# Altium schematic sheet LowCurrentSwitch.SchDoc
size A4
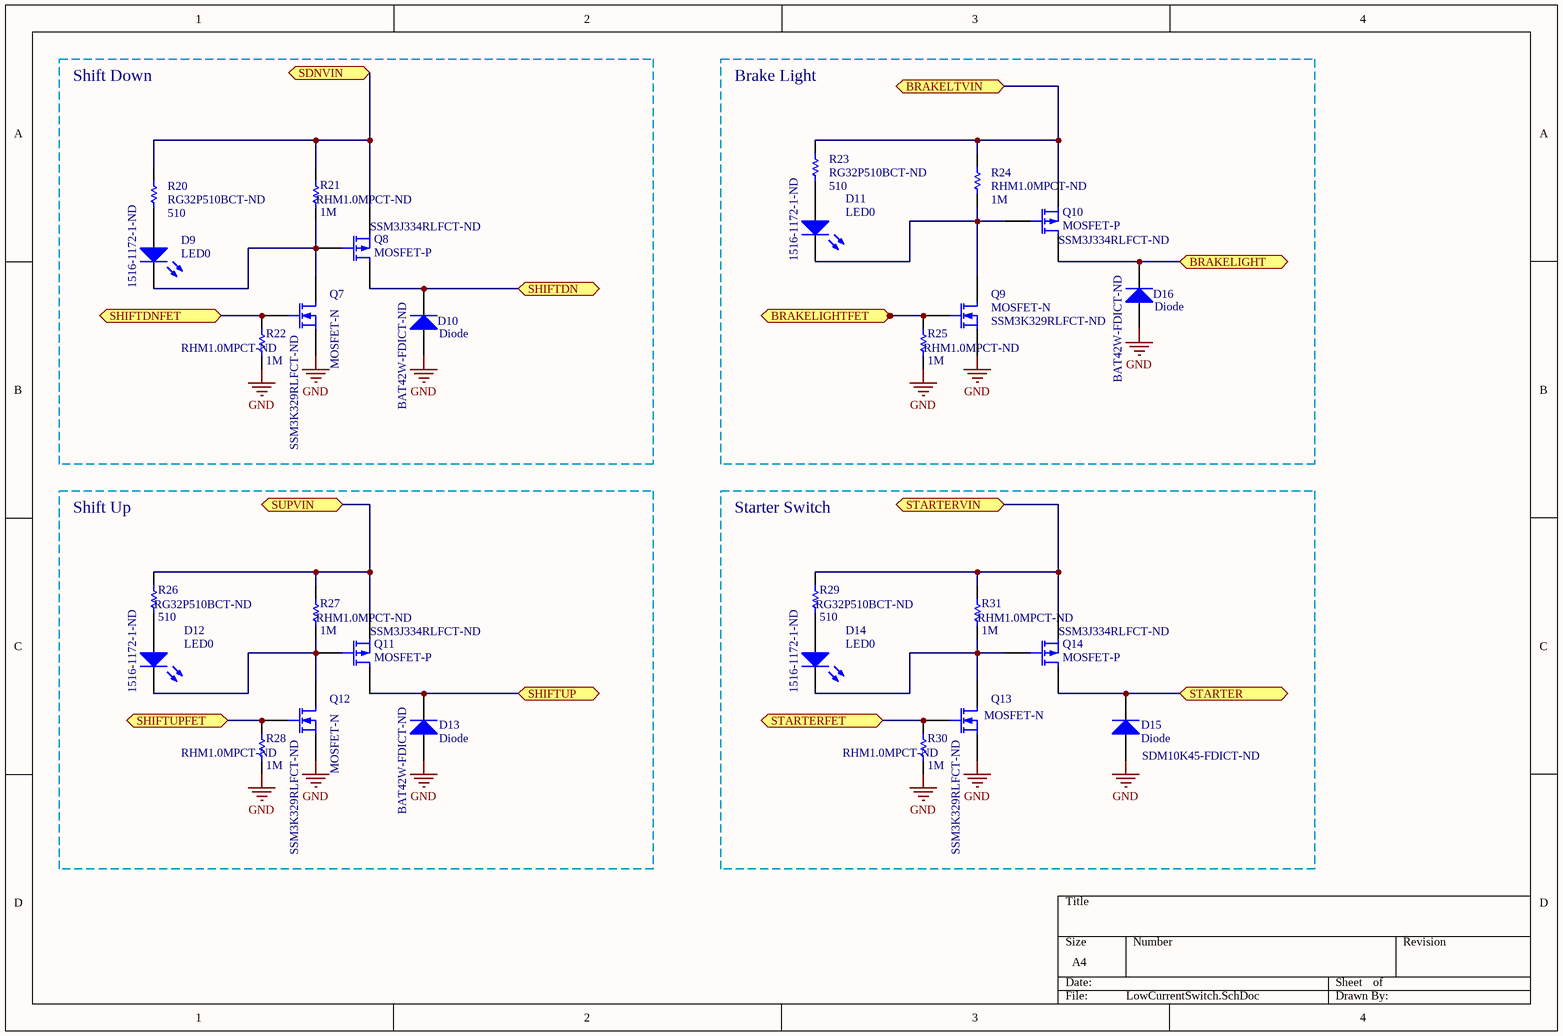
[diagram p0: LowCurrentSwitch.SchDoc]

## Parts
D9  LED0  Supplier Part Number 1: 1516-1172-1-ND  [C1206]
D10  Diode  Supplier Part Number 1: BAT42W-FDICT-ND  [sod-123]
D11  LED0  Supplier Part Number 1: 1516-1172-1-ND  [C1206]
D12  LED0  Supplier Part Number 1: 1516-1172-1-ND  [C1206]
D13  Diode  Supplier Part Number 1: BAT42W-FDICT-ND  [sod-123]
D14  LED0  Supplier Part Number 1: 1516-1172-1-ND  [C1206]
D15  Diode  Supplier Part Number 1: SDM10K45-FDICT-ND  [SOD-323]
D16  Diode  Supplier Part Number 1: BAT42W-FDICT-ND  [sod-123]
Q7  MOSFET-N  Supplier Part Number 1: SSM3K329RLFCT-ND  [SOT23f]
Q8  MOSFET-P  Supplier Part Number 1: SSM3J334RLFCT-ND  [SOT23f]
Q9  MOSFET-N  Supplier Part Number 1: SSM3K329RLFCT-ND  [SOT23f]
Q10  MOSFET-P  Supplier Part Number 1: SSM3J334RLFCT-ND  [SOT23f]
Q11  MOSFET-P  Supplier Part Number 1: SSM3J334RLFCT-ND  [SOT23f]
Q12  MOSFET-N  Supplier Part Number 1: SSM3K329RLFCT-ND  [SOT23f]
Q13  MOSFET-N  Supplier Part Number 1: SSM3K329RLFCT-ND  [SOT23f]
Q14  MOSFET-P  Supplier Part Number 1: SSM3J334RLFCT-ND  [SOT23f]
R20  value 510  Supplier Part Number 1: RG32P510BCT-ND  [C1206]  (hidden comment: 1206)
R21  value 1M  Supplier Part Number 1: RHM1.0MPCT-ND  [C1206]  (hidden comment: 1206)
R22  value 1M  Supplier Part Number 1: RHM1.0MPCT-ND  [C1206]  (hidden comment: 1206)
R23  value 510  Supplier Part Number 1: RG32P510BCT-ND  [C1206]  (hidden comment: 1206)
R24  value 1M  Supplier Part Number 1: RHM1.0MPCT-ND  [C1206]  (hidden comment: Res1)
R25  value 1M  Supplier Part Number 1: RHM1.0MPCT-ND  [C1206]  (hidden comment: Res1)
R26  value 510  Supplier Part Number 1: RG32P510BCT-ND  [C1206]  (hidden comment: 1206)
R27  value 1M  Supplier Part Number 1: RHM1.0MPCT-ND  [C1206]  (hidden comment: 1206)
R28  value 1M  Supplier Part Number 1: RHM1.0MPCT-ND  [C1206]  (hidden comment: 1206)
R29  value 510  Supplier Part Number 1: RG32P510BCT-ND  [C1206]  (hidden comment: 1206)
R30  value 1M  Supplier Part Number 1: RHM1.0MPCT-ND  [C1206]  (hidden comment: 1206)
R31  value 1M  Supplier Part Number 1: RHM1.0MPCT-ND  [C1206]  (hidden comment: 1206)

## Blocks framed on the sheet
Shift Down: D9 D10 Q7 Q8 R20-R22
Brake Light: D11 D16 Q9 Q10 R23-R25
Shift Up: D12 D13 Q11 Q12 R26-R28
Starter Switch: D14 D15 Q13 Q14 R29-R31

## Ports
BRAKELIGHT (bidir), BRAKELIGHTFET (bidir), BRAKELTVIN (bidir), SDNVIN (bidir), SHIFTDN (bidir), SHIFTDNFET (bidir), SHIFTUP (bidir), SHIFTUPFET (bidir), STARTER (bidir), STARTERFET (bidir), STARTERVIN (bidir), SUPVIN (bidir)

## Nets
GND: D10.1(A) D13.1(A) D15.1(A) D16.1(A) Q7.3(S) Q9.3(S) Q12.3(S) Q13.3(S) R22.1 R25.1 R28.1 R30.1
BRAKELIGHT: D16.2(K) Q10.1(D) ; port BRAKELIGHT
BRAKELIGHTFET: Q9.2(G) R25.2 ; port BRAKELIGHTFET
BRAKELTVIN: Q10.3(S) R23.1 R24.2 ; port BRAKELTVIN
SDNVIN: Q8.3(S) R20.1 R21.2 ; port SDNVIN
SHIFTDN: D10.2(K) Q8.1(D) ; port SHIFTDN
SHIFTDNFET: Q7.2(G) R22.2 ; port SHIFTDNFET
SHIFTUP: D13.2(K) Q11.1(D) ; port SHIFTUP
SHIFTUPFET: Q12.2(G) R28.2 ; port SHIFTUPFET
STARTER: D15.2(K) Q14.1(D) ; port STARTER
STARTERFET: Q13.2(G) R30.2 ; port STARTERFET
STARTERVIN: Q14.3(S) R29.1 R31.2 ; port STARTERVIN
SUPVIN: Q11.3(S) R26.1 R27.2 ; port SUPVIN
NetD9_1: D9.1(A) R20.2
NetD9_2: D9.2(K) Q7.1(D) Q8.2(G) R21.1
NetD11_1: D11.1(A) R23.2
NetD11_2: D11.2(K) Q9.1(D) Q10.2(G) R24.1
NetD12_1: D12.1(A) R26.2
NetD12_2: D12.2(K) Q11.2(G) Q12.1(D) R27.1
NetD14_1: D14.1(A) R29.2
NetD14_2: D14.2(K) Q13.1(D) Q14.2(G) R31.1

## Library data of the parts
D9 D11 D12 D14 = LED0: Typical INFRARED GaAs LED; Published: 8-Jun-2000; LatestRevisionDate: 08-Jul-2005; LatestRevisionNote: Mech Layer 1 removed.; PackageReference: LED-0; Publisher: Altium Limited; PackageDescription: LED; 2 Leads; Supplier 1: Digi-Key
D10 D13 D15 D16 = Diode: Default Diode; Published: 8-Jun-2000; LatestRevisionDate: 17-Jul-2002; LatestRevisionNote: Re-released for DXP Platform.; PackageVersion: Sep-1996; PackageReference: SMC; Publisher: Altium Limited; PackageDescription: DO-214-AB/SMC; 2 C-Bend Leads; Body 7.9 x 5.9 mm, inc. leads (LxW); Code_JEDEC: DO-214-AB; Supplier 1: Digi-Key
Q7 Q9 Q12 Q13 = MOSFET-N: N-Channel MOSFET; Published: 8-Jun-2000; LatestRevisionDate: 17-Jul-2002; LatestRevisionNote: Re-released for DXP Platform.; PackageVersion: 1995/1996; PackageReference: E3; Publisher: Altium Limited; PackageDescription: TO, Flat Index; 3 In-Line, Axial Leads; Body Dia. 4.6mm; Lead Dia. 0.5 mm (max); Supplier 1: Digi-Key
Q8 Q10 Q11 Q14 = MOSFET-P: P-Channel MOSFET; Published: 8-Jun-2000; LatestRevisionDate: 17-Jul-2002; LatestRevisionNote: Re-released for DXP Platform.; PackageVersion: 1995/1996; PackageReference: E3; Publisher: Altium Limited; PackageDescription: TO, Flat Index; 3 In-Line, Axial Leads; Body Dia. 4.6mm; Lead Dia. 0.5 mm (max); Supplier 1: Digi-Key
R20-R31 = Res1: Resistor; Published: 8-Jun-2000; LatestRevisionDate: 17-Jul-2002; LatestRevisionNote: Re-released for DXP Platform.; PackageReference: AXIAL-0.3; Publisher: Altium Limited; PackageDescription: Axial Device, Thru-Hole; 2 Leads; 0.3 in Pin Spacing; Supplier 1: Digi-Key